# EAGLE design solar tester (EAGLE 7.6.0)
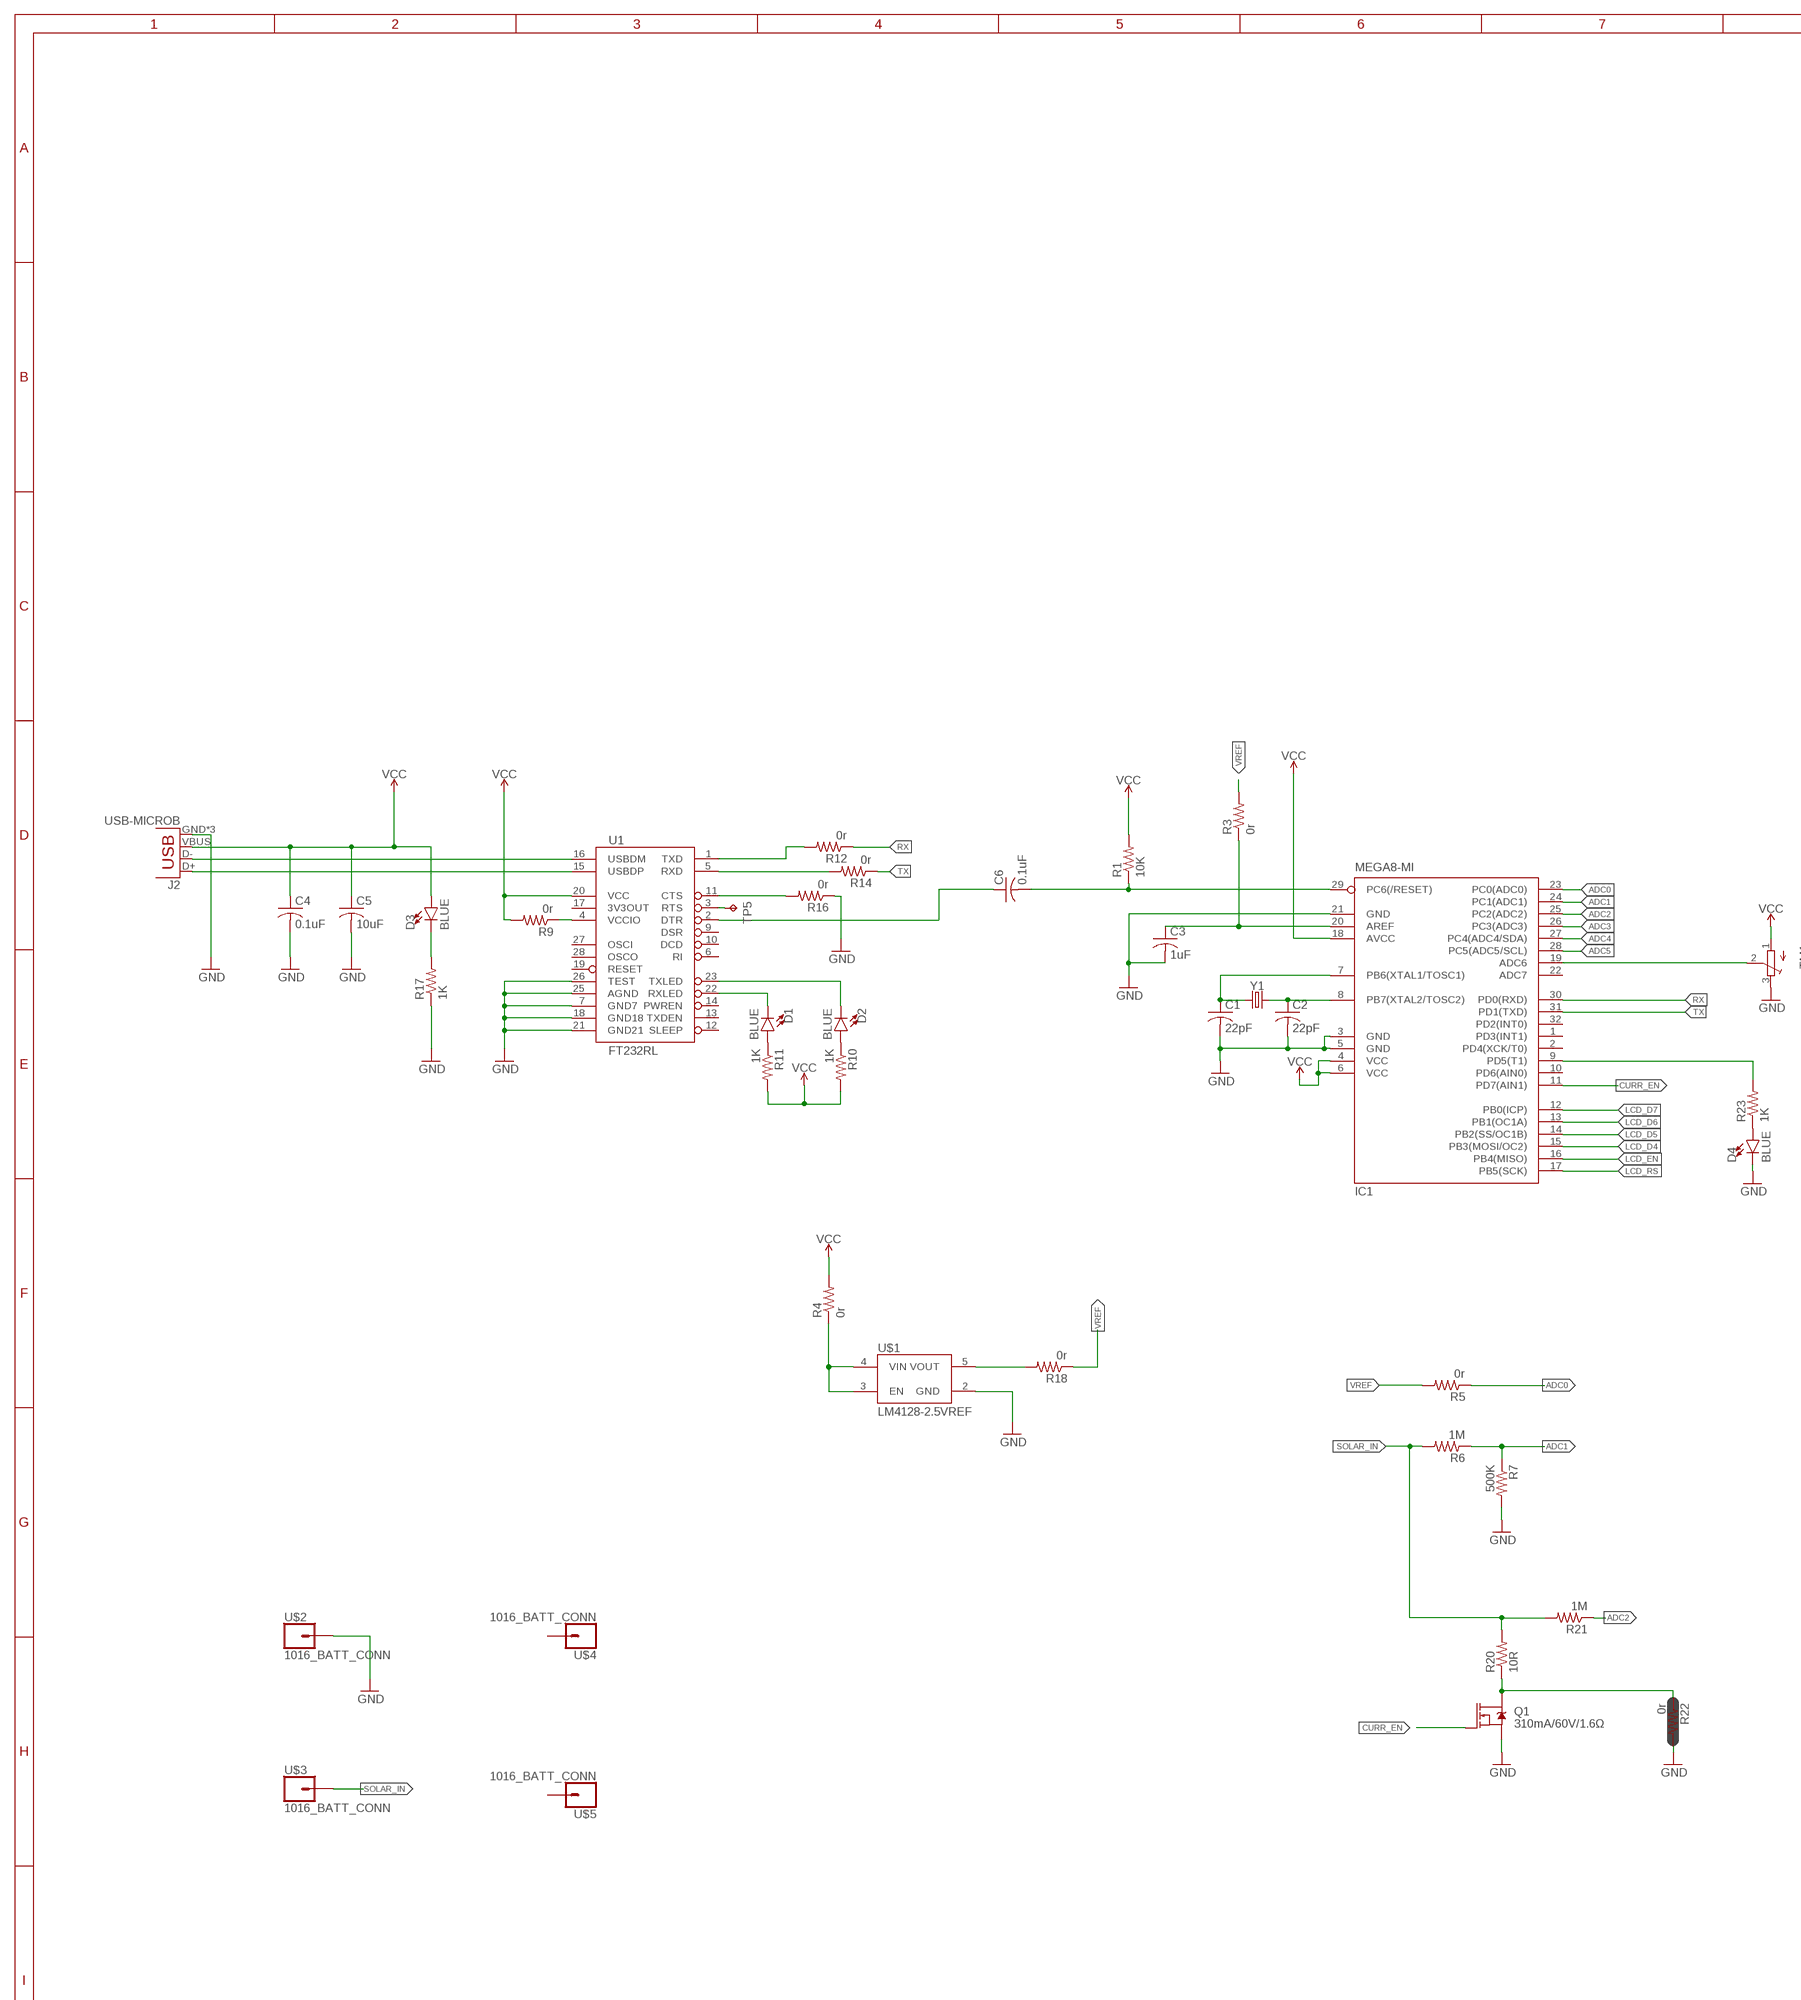
[diagram p0: schematic, sheet 1, part 1 of 2]
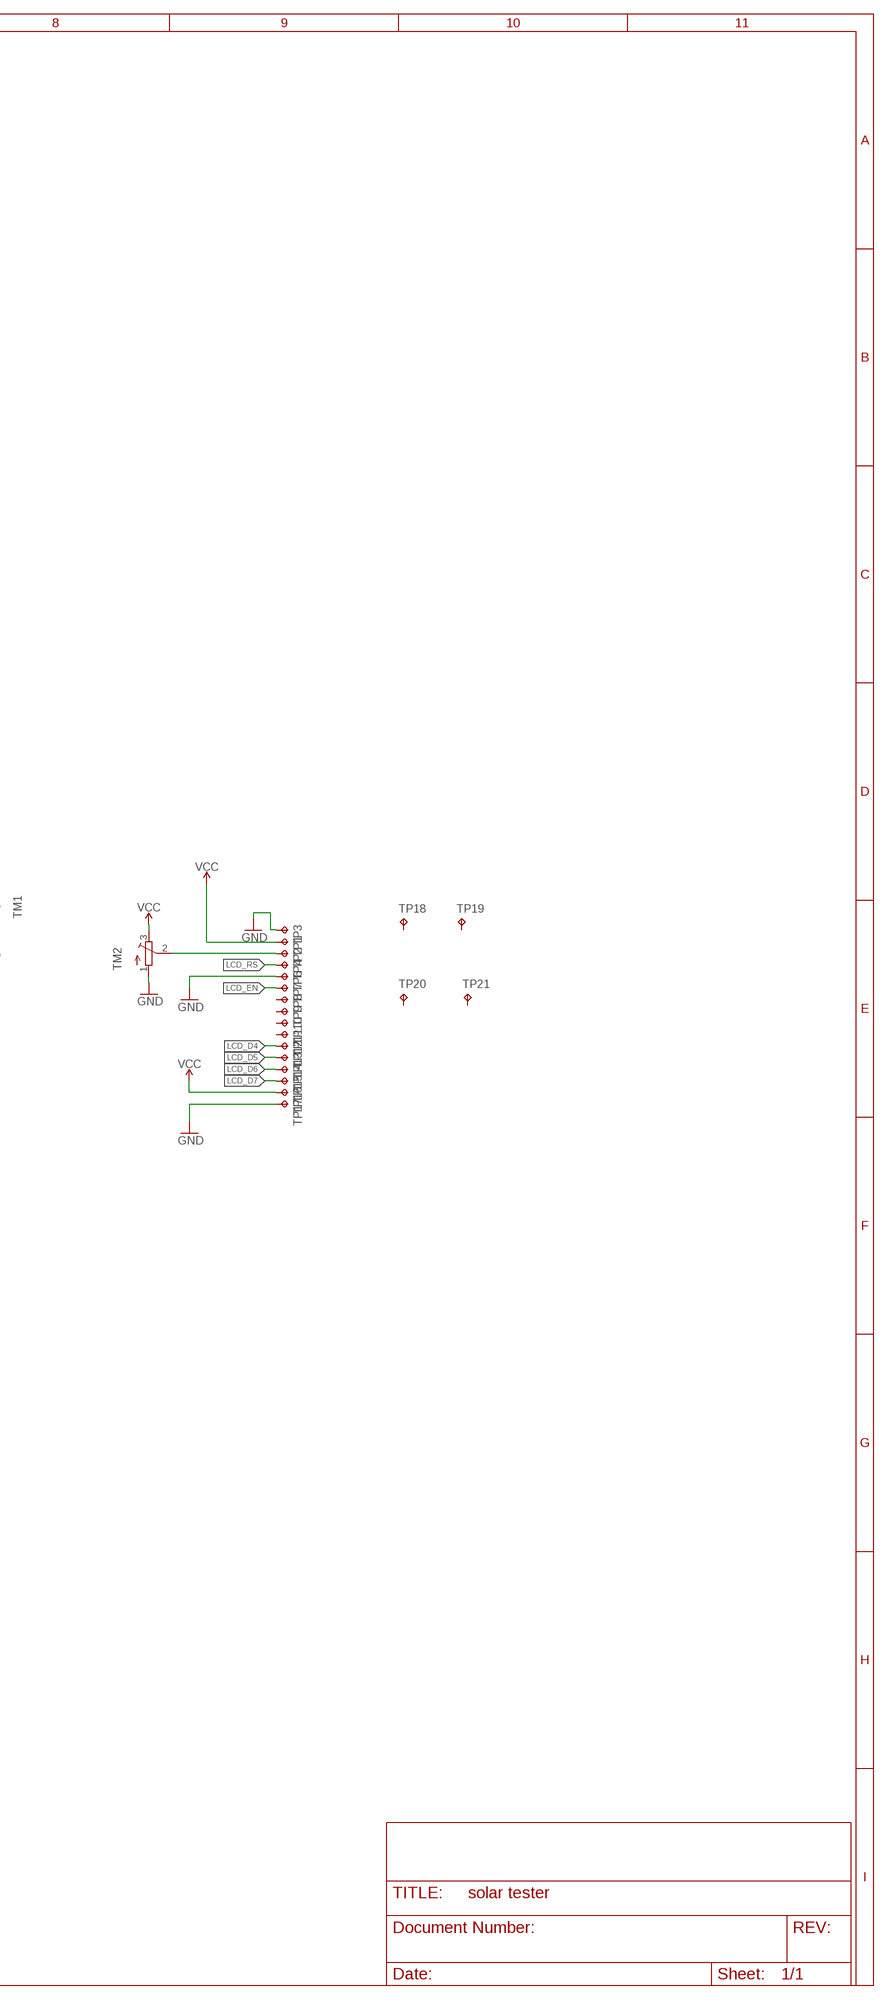
[diagram p1: schematic, sheet 1, part 2 of 2]

## Parts
C1  22pF  C-USC0402  [C0402]
C2  22pF  C-USC0402  [C0402]
C3  1uF  C-USC0402  [C0402]
C4  0.1uF  C-USC0402  [C0402]
C5  10uF  C-USC0402  [C0402]
C6  0.1uF  C-USC0402  [C0402]
D1  BLUE  LED-BLUE0603  [LED-0603]
D2  BLUE  LED-BLUE0603  [LED-0603]
D3  BLUE  LED-BLUE0603  [LED-0603]
D4  BLUE  LED-BLUE0603  [LED-0603]
IC1  MEGA8-MI  [MLF32]
J2  USB-MICROB  [USB-MICROB]
Q1  310mA/60V/1.6Ω  MOSFET-NCH-2N7002PW  [SOT323]
R1  10K  R-US_R0402  [R0402]
R3  0r  R-US_R0402  [R0402]
R4  0r  R-US_R0402  [R0402]
R5  0r  R-US_R0402  [R0402]
R6  1M  R-US_R0402  [R0402]
R7  500K  R-US_R0402  [R0402]
R9  0r  R-US_R0402  [R0402]
R10  1K  R-US_R0402  [R0402]
R11  1K  R-US_R0402  [R0402]
R12  0r  R-US_R0402  [R0402]
R14  0r  R-US_R0402  [R0402]
R16  0r  R-US_R0402  [R0402]
R17  1K  R-US_R0402  [R0402]
R18  0r  R-US_R0402  [R0402]
R20  10R  R-US_M1206  [M1206]
R21  1M  R-US_R0402  [R0402]
R22  0r  R-US_R0402  [R0402]
R23  1K  R-US_R0402  [R0402]
TM1  TRIMPOTTC33X  [TC33X]
TM2  TRIMPOTTC33X  [TC33X]
TP1  TPTP19R  [TP19R]
TP2  TPTP19R  [TP19R]
TP3  TPTP19R  [TP19R]
TP4  TPTP19R  [TP19R]
TP5  TPB1,27  [B1,27]
TP6  TPTP19R  [TP19R]
TP7  TPTP19R  [TP19R]
TP8  TPTP19R  [TP19R]
TP9  TPTP19R  [TP19R]
TP10  TPTP19R  [TP19R]
TP11  TPTP19R  [TP19R]
TP12  TPTP19R  [TP19R]
TP13  TPTP19R  [TP19R]
TP14  TPTP19R  [TP19R]
TP15  TPTP19R  [TP19R]
TP16  TPTP19R  [TP19R]
TP17  TPTP19R  [TP19R]
TP18  TPB2,54  [B2,54]
TP19  TPB2,54  [B2,54]
TP20  TPB2,54  [B2,54]
TP21  TPB2,54  [B2,54]
U1  FT232RL  FT232RLSSOP  [SSOP28DB]
U$1  LM4128-2.5VREF  [SOT23-5]
U$2  1016_BATT_CONN  [1016_BATTERY_CONNECTOR]
U$3  1016_BATT_CONN  [1016_BATTERY_CONNECTOR]
U$4  1016_BATT_CONN  [1016_BATTERY_CONNECTOR]
U$5  1016_BATT_CONN  [1016_BATTERY_CONNECTOR]
Y1  CRYSTALSMD-3.2X2.5  [CRYSTAL-SMD-3.2X2.5MM]

## Nets
ADC0: IC1.23(PC0(ADC0)) R5.1
ADC1: IC1.24(PC1(ADC1)) R6.1 R7.1
ADC2: IC1.25(PC2(ADC2)) R21.1
ADC3: IC1.26(PC3(ADC3))
ADC4: IC1.27(PC4(ADC4/SDA))
ADC5: IC1.28(PC5(ADC5/SCL))
CURR_EN: IC1.11(PD7(AIN1)) Q1.1(G)
GND: C1.2 C2.2 C3.2 C4.2 C5.2 D4.C IC1.3(GND) IC1.5(GND) IC1.21(GND) J2.GND J2.MT1(GND) J2.MT2(GND) Q1.2(S) R7.2 R16.1 R17.1 R22.2 TM1.3(E) TM2.1(A) TP3.TP TP6.TP TP17.TP U1.7(GND7) U1.18(GND18) U1.21(GND21) U1.25(AGND) U1.26(TEST) U$1.2(GND) U$2.P$1
LCD_D4: IC1.15(PB3(MOSI/OC2)) TP12.TP
LCD_D5: IC1.14(PB2(SS/OC1B)) TP13.TP
LCD_D6: IC1.13(PB1(OC1A)) TP14.TP
LCD_D7: IC1.12(PB0(ICP)) TP15.TP
LCD_EN: IC1.16(PB4(MISO)) TP7.TP
LCD_RS: IC1.17(PB5(SCK)) TP4.TP
N$1: C1.1 IC1.7(PB6(XTAL1/TOSC1)) Y1.1
N$2: C2.1 IC1.8(PB7(XTAL2/TOSC2)) Y1.3
N$3: R4.1 U$1.3(EN) U$1.4(VIN)
N$4: D1.A R11.1
N$6: TM2.2(S) TP2.TP
N$7: D2.A R10.1
N$9: J2.D- U1.16(USBDM)
N$10: J2.D+ U1.15(USBDP)
N$11: D3.C R17.2
N$12: D1.C U1.22(RXLED)
N$13: R9.1 U1.4(VCCIO)
N$14: D2.C U1.23(TXLED)
N$15: R16.2 U1.11(CTS)
N$16: R12.2 U1.1(TXD)
N$17: R14.2 U1.5(RXD)
N$18: C6.1 U1.2(DTR)
N$19: R18.2 U$1.5(VOUT)
N$20: Q1.3(D) R20.1 R22.1
N$22: IC1.19(ADC6) TM1.2(S)
N$23: D4.A R23.1
N$24: IC1.9(PD5(T1)) R23.2
N$25: C3.1 IC1.20(AREF) R3.1
N$26: TP5.TP U1.3(RTS)
RST: C6.2 IC1.29(PC6(/RESET)) R1.1
RX: IC1.30(PD0(RXD)) R12.1
SOLAR_IN: R6.2 R20.2 R21.2 U$3.P$1
TX: IC1.31(PD1(TXD)) R14.1
VCC: C4.1 C5.1 D3.A IC1.4(VCC) IC1.6(VCC) IC1.18(AVCC) J2.VBUS R1.2 R4.2 R9.2 R10.2 R11.2 TM1.1(A) TM2.3(E) TP1.TP TP16.TP U1.20(VCC)
VREF: R3.2 R5.2 R18.1
Unconnected: IC1.1(PD3(INT1)) IC1.2(PD4(XCK/T0)) IC1.10(PD6(AIN0)) IC1.22(ADC7) IC1.32(PD2(INT0)) TP8.TP TP9.TP TP10.TP TP11.TP TP18.TP TP19.TP TP20.TP TP21.TP U1.6(RI) U1.9(DSR) U1.10(DCD) U1.12(SLEEP) U1.13(TXDEN) U1.14(PWREN) U1.17(3V3OUT) U1.19(RESET) U1.27(OSCI) U1.28(OSCO) U$4.P$1 U$5.P$1

## Library data of the parts
C1-C6 = adafruit:C-US: CAPACITOR, American symbol
D1-D4 = SparkFun-LED:LED-BLUE: Blue SMD LED Used in manufacturing of various products at SparkFun Packages: 0603 - SMD 0603 package [Product Link] <http://www.digikey.com/product-detail/en/SMLE12BC7TT86/511-1589-2-ND/1641808> 1206 - SMD1206 package [Product Link] <http://www.digikey.com/product-detail/en/lite-on-inc/LTST-C150TBKT/160-1643-1-ND/573584> SparkFun Products: ESP8266 Thing-Dev Board <https://www.sparkfun.com/products/13711> RedBoard <https://www.sparkfun.com/products/12757>; PROD_ID: DIO-08575
IC1 = atmel:MEGA8: MICROCONTROLLER 8 Kbytes FLASH, 1 kbytes SRAM, 512 bytes EEPROM, USART, 6-channel 10 bit ADC, 2-channel 8 bit ADC Pin compatible with Atmega48, ATMega88, ATMega168 Source: avr.lbr; MPN: ATMEGA88PA-MU; OC_FARNELL: 1715491; OC_NEWARK: 15R0272
J2 = SparkFun-Retired:USB: USB Connectors USB-B-PTH is fully proven SKU : PRT-00139/CONN-08278 USB-miniB is fully proven SKU : PRT-00587 USB-A-PCB is untested. USB-A-H is throughly reviewed, but untested. Spark Fun Electronics SKU : PRT-00437 USB-B-SMT is throughly reviewed, but untested. Needs silkscreen touching up. USB-A-S has not been used/tested USB-MB-H has not been used/tested USB-MICROB has been used. CONN-09505; PROD_ID: CONN-09505
Q1 = SparkFun-DiscreteSemi:MOSFET-NCH: N-channel MOSFETs Voltage controlled devices that allow control of high current outputs. SparkFun Products: SparkFun OpenScale <https://www.sparkfun.com/products/13261> SparkFun Digital Sandbox <https://www.sparkfun.com/products/12651> SparkFun Monster Moto Shield <https://www.sparkfun.com/products/10182> SparkFun MOSFET Power Controller <https://www.sparkfun.com/products/11214>; PROD_ID: TRANS-11151
R1 R3-R7 R9-R12 R14 R16-R18 R21-R23 = adafruit:R-US_: RESISTOR, American symbol
R20 = resistor:R-US_: RESISTOR, American symbol
TM1 TM2 = adafruit:TRIMPOT: SMT trimmer potentiometer part number TC33X http://www.ladyada.net/library/eagle
TP1-TP21 = testpad:TP: Test pad
U1 = SparkFun-IC-Comms:FT232RL: FT232RL USB UART FT232RL 4th Generation USB UART (USB <-> Serial) Controller. Datasheet <http://www.sparkfun.com/datasheets/IC/FT232R_v104.pdf> SparkFun Products Component <https://www.sparkfun.com/products/650> (COM-00650) SparkFun RedBot Mainboard <https://www.sparkfun.com/products/12097> (ROB-12097) SparkFun FTDI Basic Breakout - 5V <https://www.sparkfun.com/products/9716> (DEV-09716) SparkFun FTDI Basic Breakout - 3.3V <https://www.sparkfun.com/products/9873> (DEV-09873) Bus Pirate - v3.6a <https://www.sparkfun.com/products/12942> (TOL-12942) SparkFun USB to Serial Breakout - FT232RL <https://www.sparkfun.com/products/12731> (BOB-12731) SparkFun PicoBoard <https://www.sparkfun.com/products/11888> (WIG-11888) SparkFun RFID USB Reader <https://www.sparkfun.com/products/9963> (SEN-09963) LilyPad FTDI Basic Breakout - 5V <https://www.sparkfun.com/products/10275> (DEV-10275) SparkFun Stepoko <https://www.sparkfun.com/products/13899> (ROB-13899); PROD_ID: IC-00870
U$1 = SparkFun-Retired:LM4128-2.5VREF: .1% accurate low-current voltage reference
U$2-U$5 = SparkFun-Connectors:1016_BATT_CONN
Y1 = SparkFun-Clocks:CRYSTAL: Crystals (Generic) These are passive quartz crystals, which can be used as a clock source for a microcontroller. Crystal's are two-terminal devices. They require external "load" capacitors to generate an oscillating signal.

## Board
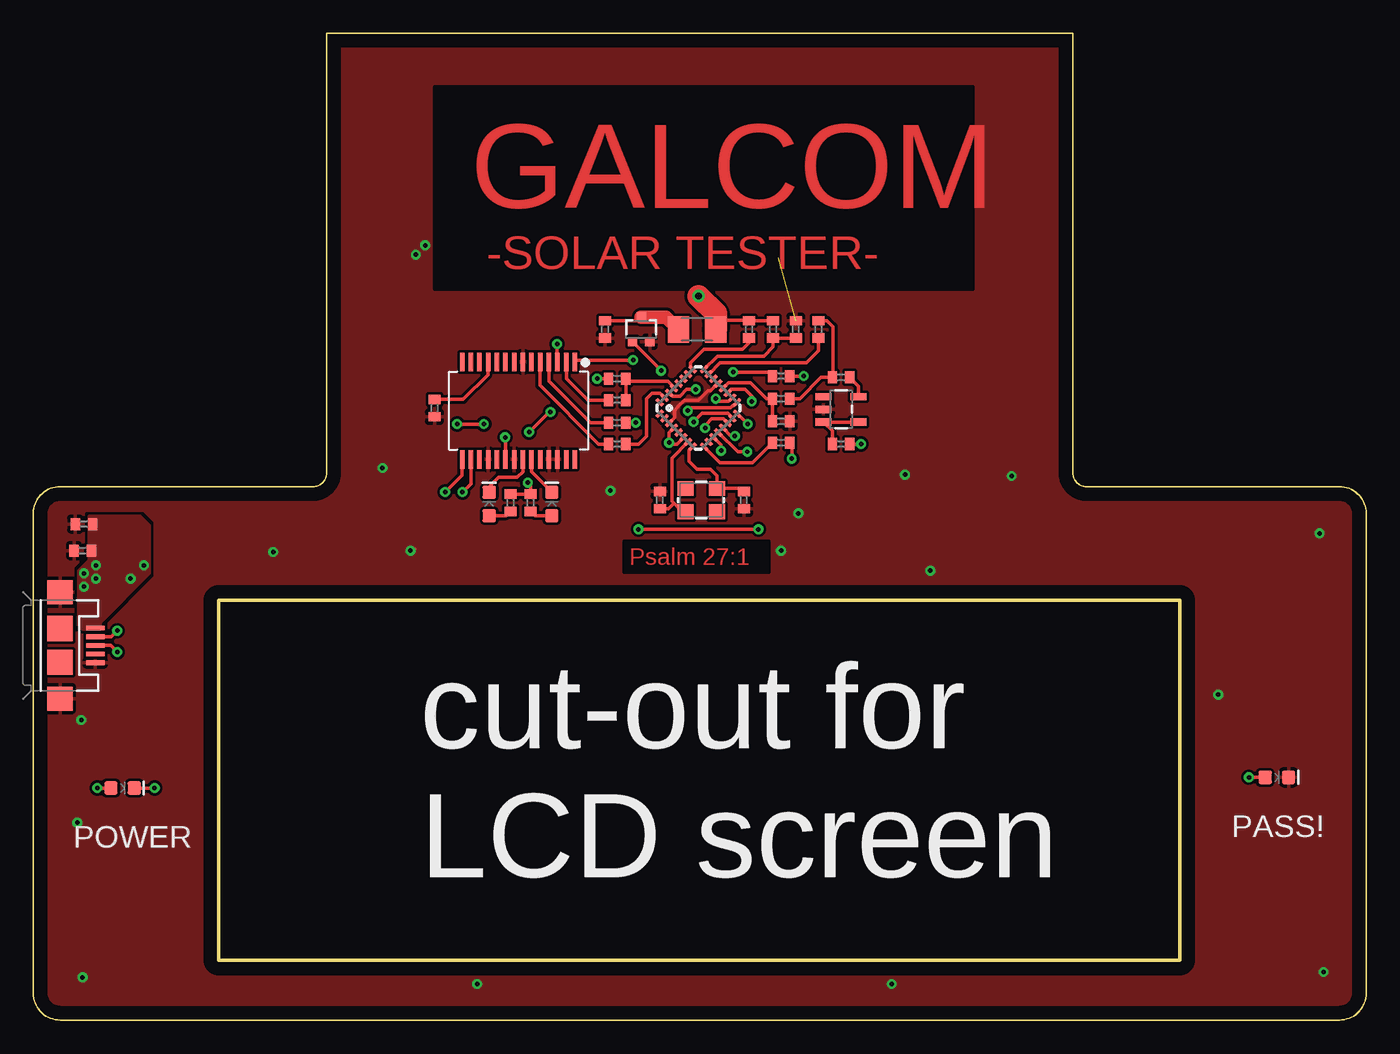
[diagram p2: board, top side]
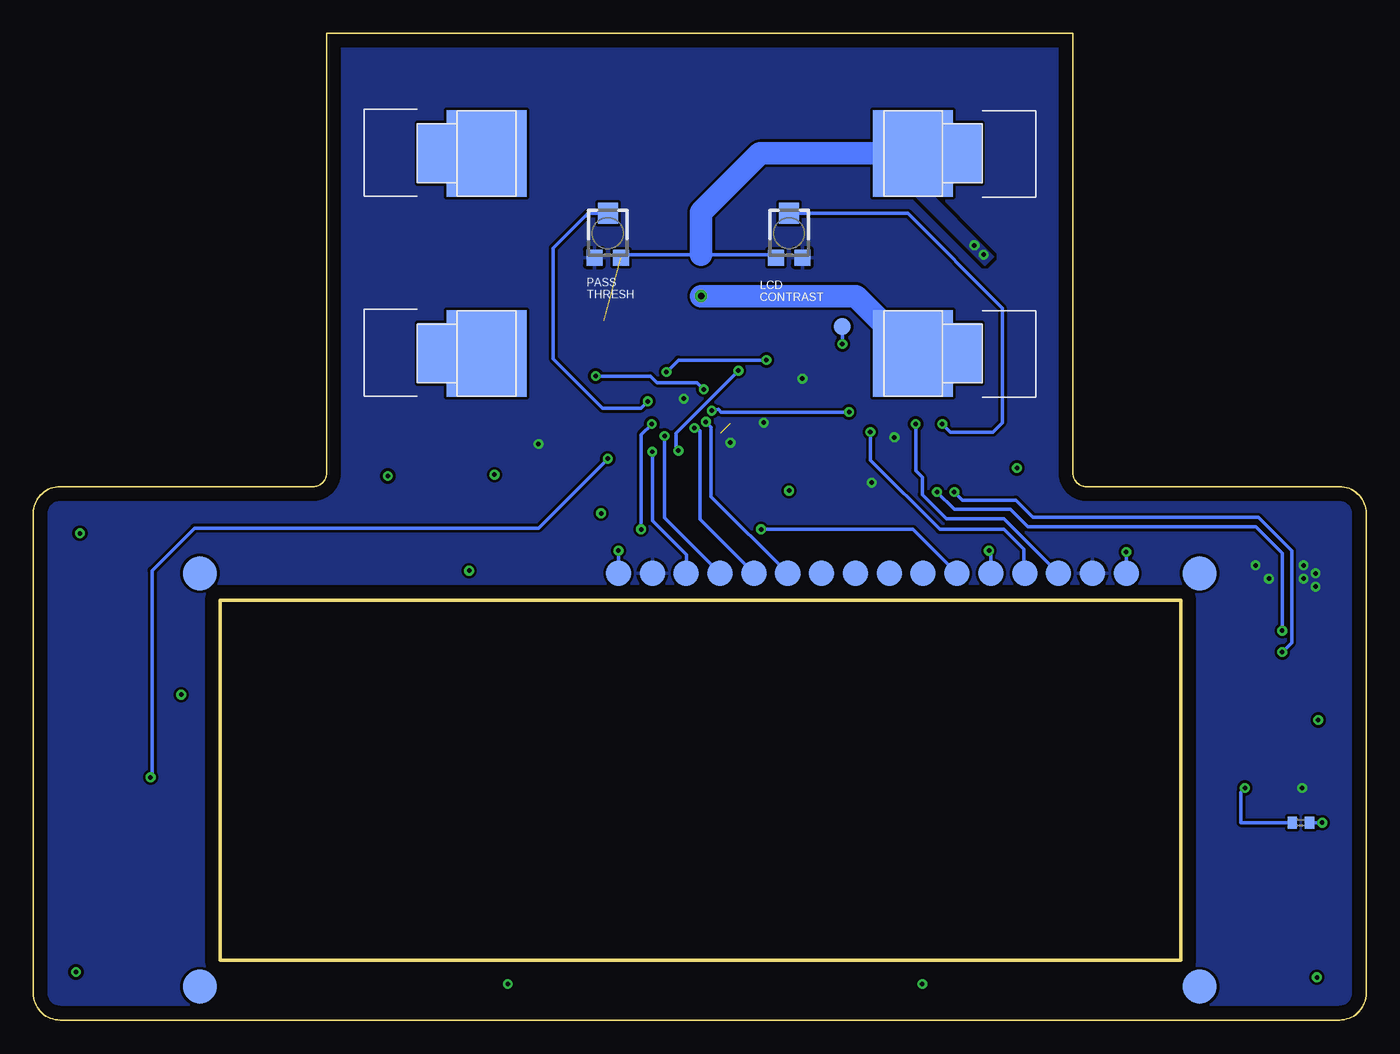
[diagram p3: board, bottom side, seen from below]

Size 100 x 74 mm. Coordinates in mm from the lower left corner, seen from the top.
Outline: 2,0 98,0 arc90 100,2 100,38 arc90 98,40 79,40 arc-90 78,41 78,74 22,74 22,41 arc-90 21,40 2,40 arc90 0,38 0,2 arc90 2,0
Outline: 13.9,31.5 13.9,4.5 86,4.5 86,31.5 13.9,31.5
Copper layers (1*16): Top 0.035mm / dielectric 1.5mm / Bottom 0.035mm
Design rules "default *": minimum track width 10mil, minimum drill 24mil, track to track 8mil, track to pad 8mil, pad to pad 8mil, via to via 8mil, smd to smd 8mil, copper to edge 40mil, drill to drill 8mil, minimum pad ring 10mil, minimum via ring 8mil, stop-mask expansion 4mil, vias tented up to drill 20mil, thermal gap 10mil
tRestrict: area 30.1,54.8 to 70.5,70; area 44.3,33.6 to 55.2,35.9
Milling: area 13.9,4.5 to 86,31.5

### Footprints (pad centres in the part's own frame; a part is rotated, then mirrored left to right if it is on the bottom)
C0402 = smd 0.7 x 0.9: 1 -0.65,0; 2 0.65,0
LED-0603 = smd 1 x 1: A -0.877,0; C 0.877,0
MLF32 = smd 0.7 x 0.3: 1 -2.35,1.75; 2 -2.35,1.25; 3 -2.35,0.75; 4 -2.35,0.25; 5 -2.35,-0.25; 6 -2.35,-0.75; 7 -2.35,-1.25; 8 -2.35,-1.75; 17 2.35,-1.75; 18 2.35,-1.25; 19 2.35,-0.75; 20 2.35,-0.25; 21 2.35,0.25; 22 2.35,0.75; 23 2.35,1.25; 24 2.35,1.75 | smd 0.3 x 0.7: 9 -1.75,-2.35; 10 -1.25,-2.35; 11 -0.75,-2.35; 12 -0.25,-2.35; 13 0.25,-2.35; 14 0.75,-2.35; 15 1.25,-2.35; 16 1.75,-2.35; 25 1.75,2.35; 26 1.25,2.35; 27 0.75,2.35; 28 0.25,2.35; 29 -0.25,2.35; 30 -0.75,2.35; 31 -1.25,2.35; 32 -1.75,2.35
USB-MICROB = smd 0.35 x 1.4: D+ 0,2.65; D- -0.65,2.65; GND 1.3,2.65; ID 0.65,2.65; VBUS -1.3,2.65 | smd 1.8 x 1.9: MT1 -4,0; MT2 4,0 | smd 1.9 x 1.9: P$1 -1.27,0; P$2 1.27,0
SOT323 = smd 0.7 x 0.7: 1 -0.65,-0.925; 2 0.65,-0.925; 3 0,0.925
R0402 = smd 0.7 x 0.9: 1 -0.65,0; 2 0.65,0
M1206 = smd 1.6 x 2: 1 -1.4,0; 2 1.4,0
TC33X = smd 1.2 x 1.2: 1 -1,-1.825; 3 1,-1.825 | smd 1.5 x 1.6: 2 0,1.5
TP19R = smd 1.9 x 1.9: TP 0,0
B1,27 = smd 1.27 x 1.27: TP 0,0
B2,54 = smd 2.54 x 2.54: TP 0,0
SSOP28DB = smd 0.348 x 1.397: 1 -4.225,-3.656; 2 -3.575,-3.656; 3 -2.925,-3.656; 4 -2.275,-3.656; 5 -1.625,-3.656; 6 -0.975,-3.656; 7 -0.325,-3.656; 8 0.325,-3.656; 9 0.975,-3.656; 10 1.625,-3.656; 11 2.275,-3.656; 12 2.925,-3.656; 13 3.575,-3.656; 14 4.225,-3.656; 15 4.225,3.656; 16 3.575,3.656; 17 2.925,3.656; 18 2.275,3.656; 19 1.625,3.656; 20 0.975,3.656; 21 0.325,3.656; 22 -0.325,3.656; 23 -0.975,3.656; 24 -1.625,3.656; 25 -2.275,3.656; 26 -2.925,3.656; 27 -3.575,3.656; 28 -4.225,3.656
SOT23-5 = smd 0.55 x 1.2: 1 -0.95,-1.3; 2 0,-1.3; 3 0.95,-1.3; 4 0.95,1.3; 5 -0.95,1.3
1016_BATTERY_CONNECTOR = smd 6 x 6.5: P$1 0,0 | smd 6.5 x 4.5: P$2 -1.9,0
CRYSTAL-SMD-3.2X2.5MM = smd 1.2 x 1.1: 1 -1.175,-0.875; 2 1.175,-0.875; 3 1.175,0.875; 4 -1.175,0.875

### Placement (x,y rotation side)
C1  47,39 90 top
C2  53.3,39 270 top
C3  56.1,44.9 0 top
C4  3.7,35.2 180 top
C5  3.8,37.2 180 top
C6  43.8,46.5 0 top
D1  34.2,38.7 90 top
D2  38.9,38.7 90 top
D3  6.7,17.4 0 top
D4  93.3,18.2 0 top
IC1  49.9,45.9 45 top
J2  2,28.1 270 top
Q1  45.6,51.8 0 top
R1  43.8,48.1 180 top
R3  56.1,46.6 0 top
R4  60.6,43.2 0 top
R5  58.9,51.8 90 top
R6  55.5,51.8 90 top
R7  57.2,51.8 90 top
R9  43.8,44.8 0 top
R10  37.3,38.8 90 top
R11  35.8,38.8 90 top
R12  56.1,48.3 180 top
R14  43.8,43.2 180 top
R16  30.1,45.9 90 top
R17  4.9,14.8 180 bottom
R18  60.6,48.2 0 top
R20  49.8,51.8 0 top
R21  53.7,51.8 90 top
R22  42.9,51.8 270 top
R23  56.1,43.3 180 top
TM1  56.9,59 0 bottom
TM2  43.3,59 0 bottom
TP1  20.54,33.5 0 bottom
TP2  23.08,33.5 0 bottom
TP3  18,33.5 0 bottom
TP4  25.62,33.5 90 bottom
TP5  39.3,52 0 bottom
TP6  28.16,33.5 90 bottom
TP7  30.7,33.5 90 bottom
TP8  33.24,33.5 90 bottom
TP9  35.78,33.5 90 bottom
TP10  38.32,33.5 90 bottom
TP11  40.86,33.5 90 bottom
TP12  43.4,33.5 90 bottom
TP13  45.94,33.5 90 bottom
TP14  48.48,33.5 90 bottom
TP15  51.02,33.5 90 bottom
TP16  53.56,33.5 90 bottom
TP17  56.1,33.5 90 bottom
TP18  87.5,33.5 0 bottom
TP19  12.5,33.5 0 bottom
TP20  12.5,2.5 0 bottom
TP21  87.5,2.5 0 bottom
U1  36.4,45.7 180 top
U$1  60.6,45.8 270 top
U$2  34,65 180 bottom
U$3  34,50 180 bottom
U$4  66,65 0 bottom
U$5  66,50 0 bottom
Y1  50.1,39 0 top

### Tracks (layer width: path | path; a pad name or v marks a point on that pad's centre or on a via)
ADC0
  Top 0.254: R5.1 58.9,50.2 58,49.3 51.53,49.3 IC1.23
ADC1
  Top 0.254: R7.1 R6.1 55.5,50.5 54.8,49.8 51.33,49.8 IC1.24
ADC2
  Top 0.254: R21.1 53.7,50.8 53.2,50.3 50.3,50.3 49.3,49.3 49.3,48.98 IC1.25
CURR_EN  (via drill 0.33)
  Top 0.254: Q1.1 47.1,48.73 v47.1,48.7 | 51.03,43.67 IC1.11 51.6,43.14 v51.6,42.7
  Bottom 0.254: v47.1,48.7 51.8,44 51.8,42.9 v51.6,42.7
GND  (via drill 0.33)  (2 unrouted)
  Top 0.254: v3.3,14.8 3.2,14.8 3.1,14.9 | v28.3,35.2 28.5,35.2 28.6,35.3 | IC1.21 51.34,47.74 50.8,47.2 50.6,47.2 49.9,46.5 48.84,46.5 48.38,46.04 48.38,45.98 48.1,45.7 48.1,45.16 IC1.3 | v56.1,35.2 56.1,35.5
  Bottom 0.254: TM2.1 44.52,57.4 49.9,57.4 55.67,57.4 TM1.3 | R17.1 v3.3,14.8 | TP6.TP 28.16,35.06 v28.3,35.2 | TP3.TP v18,35.1 | TP17.TP v56.1,35.2
  Bottom 1.676: U$2.P$1 45.5,65 49.9,60.6 49.9,57.4
  other vias: 26.2,41.4 43.3,39.7 57.4,38 65.4,40.9 73.4,40.8 67.3,33.7 96.5,36.5 88.9,24.4 96.8,3.6 3.7,3.2 33.3,2.7 64.4,2.7 3.6,22.5 29.4,58.1 28.7,57.4
  pour Top (rank 3): -1.8,41.2 -1.8,-1.9 101.7,-1.9 101.7,42 80,42 80,76.1 20.1,76.1 20.1,41.2
  pour Bottom (no thermals): 28.6,56.6 34.6,62.6 34.6,65.7 33.5,65.7 33.5,62.8 27.96,57.26
LCD_D4  (via drill 0.33)
  Top 0.254: IC1.15 52.44,45.12 52.44,45.16 52.1,45.5 50.18,45.5 v49.54,44.86
  Bottom 0.254: TP12.TP 49.14,39.24 49.14,44.46 v49.54,44.86
LCD_D5  (via drill 0.33)
  Top 0.254: IC1.14 52.09,44.81 52.05,44.81 51.78,45.08 50.88,45.08 50.5,44.7 v50.4,44.4
  Bottom 0.254: TP13.TP 50,37.56 50,44.2 v50.4,44.4
LCD_D6  (via drill 0.33)
  Top 0.254: IC1.13 52.36,43.8 v52.64,43.8
  Bottom 0.254: v52.64,43.8 52.64,37.66 TP14.TP
LCD_D7  (via drill 0.33)
  Top 0.254: IC1.12 51.42,44.06 52.86,42.62 v53.56,42.62
  Bottom 0.254: v53.56,42.62 53.56,37.46 51,34.9 51,33.52 TP15.TP
LCD_EN  (via drill 0.33)
  Top 0.254: IC1.16 52.82,45.48 v53.6,44.7 | v54.4,36.8 v45.4,36.8
  Bottom 0.254: v53.6,44.7 54.4,43.9 v54.4,36.8 | v45.4,36.8 34,36.8 TP7.TP
LCD_RS  (via drill 0.33)
  Top 0.254: IC1.17 52.53,46.06 52.44,46.06 52.3,45.92 49.12,45.92 v49.1,45.7 | v38.8,45.6 38.7,45.6 v37.2,44.1
  Bottom 0.254: v38.8,45.6 48.4,45.6 48.6,45.8 v49.1,45.7 | TP4.TP 25.7,33.58 25.7,35.3 27.2,36.8 32,36.8 37.2,42 v37.2,44.1
N$1
  Top 0.254: Y1.1 48.67,38.12 48.05,38.75 | 48.05,38.75 47.9,38.9 47.9,42.13 IC1.7 | C1.1 47.65,38.35 48.05,38.75
N$2
  Top 0.254: C2.1 53.08,39.88 Y1.3 51.27,40.83 50.8,41.3 49.8,41.3 49.2,41.9 49.2,42.73 IC1.8
N$3
  Top 0.254: R4.1 59.95,44.2 U$1.3 U$1.4
N$4
  Top 0.254: D1.A 35.47,37.82 R11.1
N$6  (via drill 0.33)
  Top 0.254: v31.8,44.7 v33.8,44.7
  Bottom 0.254: TM2.2 34.4,60.5 27.3,53.4 27.3,44.8 28,44.1 31.2,44.1 v31.8,44.7 | TP2.TP 27.18,37.6 31.5,37.6 33.3,39.4 33.3,40.7 33.8,41.2 v33.8,44.7
N$7
  Top 0.254: D2.A 37.63,37.82 R10.1
N$9  (via drill 0.33)
  Top 0.254: J2.D- 5.85,28.75 v6.3,29.2 | v32.2,39.6 32.83,40.23 U1.16
  Bottom 0.254: v32.2,39.6 30.9,38.3 26.7,38.3 25.4,37 8.3,37 6.3,35 v6.3,29.2
N$10  (via drill 0.33)
  Top 0.254: J2.D+ 5.8,28.1 v6.3,27.6 | v30.9,39.6 32.17,40.88 U1.15
  Bottom 0.254: v6.3,27.6 5.6,28.3 5.6,35.2 8.1,37.7 25,37.7 26.3,39 30.3,39 v30.9,39.6
N$11  (via drill 0.33)
  Top 0.254: D3.C v9.1,17.4
  Bottom 0.254: v9.1,17.4 9.4,17.1 9.4,14.8 R17.2
N$12
  Top 0.254: U1.22 36.73,41.12 36.3,40.7 34.9,40.7 34.3,40.1 34.3,39.68 D1.C
N$13
  Top 0.254: R9.1 41.8,44.8 38.7,47.9 38.7,49.33 U1.4
N$14
  Top 0.254: U1.23 37.38,41.1 D2.C
N$15
  Top 0.254: R16.2 32.25,46.55 34.1,48.4 34.1,49.33 U1.11
N$16  (via drill 0.33)
  Top 0.254: R12.2 55.15,48.6 v52.5,48.6 | v45,49.5 40.77,49.5 arc90 U1.1
  Bottom 0.254: v52.5,48.6 51.6,49.5 v45,49.5
N$17
  Top 0.254: R14.2 42.4,43.2 38,47.6 38,49.33 U1.5
N$18
  Top 0.254: C6.1 41.6,46.5 40,48.1 40,49.33 U1.2
N$19
  Top 0.254: U$1.5 61.9,47.55 R18.2
N$20
  Top 0.254: R22.1 45.33,52.45 Q1.3
  Top 1.016: R20.1 47.48,52.73 Q1.3
N$22  (via drill 0.33)
  Top 0.254: v53.9,46.4 53.9,46.8 53.4,47.3 52.36,47.3 IC1.19
  Bottom 0.254: TM1.2 58.4,60.5 61,57.9 61,49.6 57.3,45.9 54.4,45.9 v53.9,46.4
N$23  (via drill 0.33)
  Top 0.254: R23.1 56.9,43.15 v56.9,42.1 | v91.2,18.2 D4.A
  Bottom 0.254: v56.9,42.1 62.1,36.9 87.9,36.9 91.1,33.7 91.1,18.3 v91.2,18.2
N$24
  Top 0.254: IC1.9 51.52,41.8 53.95,41.8 R23.2
N$25
  Top 0.254: C3.1 R3.1 55,46.6 53.8,47.8 52.15,47.8 IC1.20
N$26  (via drill 0.33)
  Top 0.254: U1.3 39.3,49.38 v39.3,50.7
  Bottom 0.254: v39.3,50.7 TP5.TP
RST
  Top 0.254: C6.2 R1.1 44.65,47.9 47.6,47.9 48.06,47.44 IC1.29
RX  (via drill 0.33)
  Top 0.254: R12.1 v57.8,48.3 | IC1.30 47.94,46.8 48.5,46.8 49,47.3 v49.7,47.3
  Bottom 0.254: v57.8,48.3 53.7,48.3 53.2,47.8 50.2,47.8 v49.7,47.3
SOLAR_IN  (via drill 0.5)
  Top 0.254: R6.2 R21.2 53.65,52.5 51.2,52.5
  Top 1.676: v49.9,54.3 51.2,53 51.2,52.5 R20.2
  Bottom 1.676: U$3.P$1 38.3,54.3 v49.9,54.3
TX
  Top 0.254: IC1.31 47.03,47 46.4,47 46,46.6 46,43.8 45.4,43.2 R14.1
VCC  (via drill 0.33)
  Top 0.254: D3.A v4.8,17.4 | U1.20 35.42,43.67 v35.4,43.7 | v37.1,40.3 37.3,40.1 R10.2 R11.2 | IC1.4 47.7,44.05 v47.7,43.3 47.8,43.2 48.3,43.2 48.77,43.67 IC1.6 | IC1.18 52.44,46.68 52.16,46.4 51.4,46.4 v51.2,46.6 | R4.2 v62.1,43.2 | R9.2 v45.2,44.8 | R1.2 v42.3,48.1
  Bottom 0.254: v4.8,17.4 4.6,17.4 | v51.2,46.6 51.1,46.5 | v62.1,43.2 62.2,43.1
  other vias: 3.8,33.5 4.7,34.1 3.8,32.5 4.7,33.1 7.3,33.1 8.3,34.1
  pour Bottom (rank 3): -4.6,44.2 -4.6,-5.4 105.4,-5.4 105.4,47 83.8,47 83.8,79.7 15,79.7 15,44.2
  pour Top (no thermals): 5,29.3 5,29.8 8.7,33.5 8.7,37.1 8,37.8 4.2,37.8 4.2,34.5 3.4,33.7 3.4,29.6 3.7,29.3
VREF
  Top 0.254: R3.2 57.5,46.6 59.1,48.2 R18.1 60,48.25 60,52 59.55,52.45 R5.2

### Text on the board
Top: GALCOM | -SOLAR TESTER- | Psalm 27:1
tNames: PASS! | POWER | cut-out for / LCD screen
bNames: LCD / CONTRAST | PASS / THRESH